# Altium schematic sheet MAIN.SchDoc
size A4; SheetNumber: 1; SheetTotal: 1; SPICEModelCacheFDUFBSJX: <root> / <DocumentId>FDUFBSJX</DocumentId> / </root>
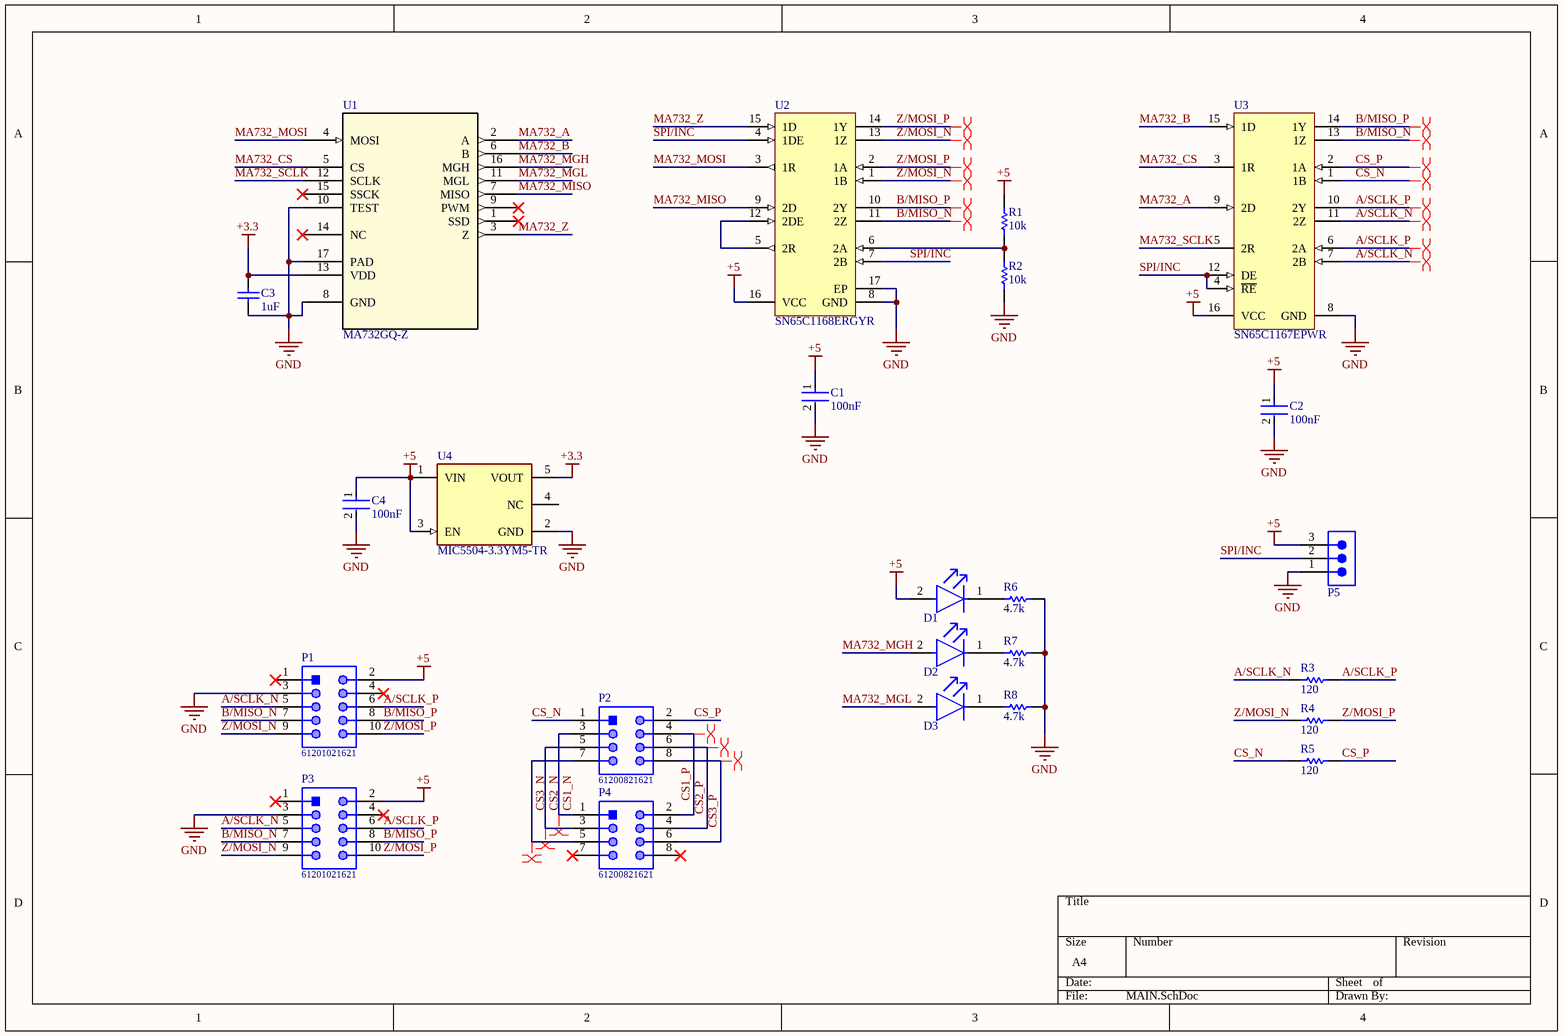
[diagram p0: MAIN.SchDoc]

## Parts
C1  100nF  [FP-C0805C-DN-MFG]
C2  100nF  [FP-C0805C-DN-MFG]
C3  1uF  [CAPC2013X70X45NL10T25]
C4  100nF  [FP-C0805C-DN-MFG]
D1  150080SS75000  [FP-150080SS75000-MFG]  (value not drawn)
D2  150080SS75000  [FP-150080SS75000-MFG]  (value not drawn)
D3  150080SS75000  [FP-150080SS75000-MFG]  (value not drawn)
P1  61201021621  [61201021621]
P2  61200821621  [61200821621]
P3  61201021621  [61201021621]
P4  61200821621  [61200821621]
P5  TSW-103-07-T-S  [SMTC-TSW-103-07-X-S]  (value not drawn)
R1  10k  [RESC2013X60X40LL20T25_A]
R2  10k  [RESC2013X60X40LL20T25_A]
R3  120  [RESC2013X60X40ML20T25]
R4  120  [RESC2013X60X40ML20T25]
R5  120  [RESC2013X60X40ML20T25]
R6  4.7k  [RESC2013X70X40NL20T20]
R7  4.7k  [RESC2013X70X40NL20T20]
R8  4.7k  [RESC2013X70X40NL20T20]
U1  MA732GQ-Z  [QFN-16_MA732]
U2  SN65C1168ERGYR  [RGY0016A_V]
U3  SN65C1167EPWR  [PW0016A_M]
U4  MIC5504-3.3YM5-TR  [FP-SOT23-5LD-PL-1-MFG]

## Nets
+3.3: C3.2 U1.13(VDD) U4.5(VOUT)
+5: C1.1 C2.1 C4.1 D1.2(A) P1.2 P3.2 P5.3 R1.2 U2.16(VCC) U3.16(VCC) U4.1(VIN) U4.3(EN)
GND: C1.2 C2.2 C3.1 C4.2 P1.3 P3.3 P5.1 R2.1 R6.2 R7.2 R8.2 U1.8(GND) U1.10(TEST) U1.17(PAD) U2.8(GND) U2.17(EP) U3.8(GND) U4.2(GND)
A/SCLK_N: P1.5 P3.5 R3.1 U3.7(2B) U3.11(2Z)
A/SCLK_P: P1.6 P3.6 R3.2 U3.6(2A) U3.10(2Y)
B/MISO_N: P1.7 P3.7 U2.11(2Z) U3.13(1Z)
B/MISO_P: P1.8 P3.8 U2.10(2Y) U3.14(1Y)
CS1_N: P2.3 P4.1
CS1_P: P2.4 P4.2
CS2_N: P2.5 P4.3
CS2_P: P2.6 P4.4
CS3_N: P2.7 P4.5
CS3_P: P2.8 P4.6
CS_N: P2.1 R5.1 U3.1(1B)
CS_P: P2.2 R5.2 U3.2(1A)
MA732_A: U1.2(A) U3.9(2D)
MA732_B: U1.6(B) U3.15(1D)
MA732_CS: U1.5(CS) U3.3(1R)
MA732_MGH: D2.2(A) U1.16(MGH)
MA732_MGL: D3.2(A) U1.11(MGL)
MA732_MISO: U1.7(MISO) U2.9(2D)
MA732_MOSI: U1.4(MOSI) U2.3(1R)
MA732_SCLK: U1.12(SCLK) U3.5(2R)
MA732_Z: U1.3(Z) U2.15(1D)
SPI/INC: P5.2 U2.4(1DE) U2.7(2B) U3.4(~{RE}) U3.12(DE)
Z/MOSI_N: P1.9 P3.9 R4.1 U2.1(1B) U2.13(1Z)
Z/MOSI_P: P1.10 P3.10 R4.2 U2.2(1A) U2.14(1Y)
NetD1_1: D1.1(C) R6.1
NetD2_1: D2.1(C) R7.1
NetD3_1: D3.1(C) R8.1
NetR1_1: R1.1 R2.2 U2.6(2A)
NetU2_5: U2.5(2R) U2.12(2DE)

Not connected (* = marked no-connect by the designer): P1 1* 4*; P3 1* 4*; P4 7* 8*; U1 1(SSD)* 9(PWM)* 14(NC)* 15(SSCK)*; U4 4(NC)

## Layout directives
differential pair: A/SCLK_N, A/SCLK_P, B/MISO_N, B/MISO_P, CS1_N, CS1_P, CS2_N, CS2_P, CS3_N, CS3_P, CS_N, CS_P, Z/MOSI_N, Z/MOSI_P

## Library data of the parts
C1 C2 C4 = CMP-2007-00279-2: CAP CER 0.1UF 50V X7R 0805; Manufacturer Part Number: C0805C104K5RACTU; Manufacturer: KEMET; Value: 0.10 μF; Tolerance: 0.1; Temperature Coefficient: 30ppm/°C; Material: Ceramic; Device Class L2: Capacitors; Temperature Range Low: -55°C; Voltage Rating: 50 V; Digikey Description: CAP CER 0.1UF 50V X7R 0805; Category: Cap; ComponentLink2Description: Datasheet; Octopart: https://octopart.com/c0805c104k5ractu-kemet-143926; RoHS: TRUE; ComponentLink2URL: https://content.kemet.com/datasheets/KEM_C1003_C0G_SMD.pdf; Temperature Characteristic: X7R; Temperature: -55°C to +125°C; Height: 0.88mm; Temperature Range High: +125°C; Device Class L1: Passive Components; Automotive: No; Lead Free: Yes; Ipc Land Pattern Name: CAPC200125X78; Device Class L3: Ceramic Capacitors; Mouser Description: Cap Ceramic 0.1uF 50V X7R 10% SMD 2.0 x 1.2 mm 125 C Paper T/R; Capacitance: 0.10 μF; Package: C0805C-DN
C3 = CMP-2007-00957-1: Part Number: GRM216R61E105KA12D; Manufacturer: Murata
D1-D3 = CMP-1426-00010-2: LED RED CLEAR 0805 SMD; Forward Voltage: 1.9V; Luminous Intensity: 60mcd; Dominant Wavelength: 630nm; Forward Current: 30mA; Viewing Angle: 140°; Lens Color: Colorless; Test Current: 20mA; Lens Size: 1.25mm; Packaging: Cut Tape; Width: 1.25mm; Case Code (Metric): 2012; Max Operating Temperature: 85°C; RoHS Compliant: Yes; Mount: Surface Mount; Case/Package: 0805; Series: WL-SMCW; Length: 2mm; Case Code (Imperial): 0805; Wavelength: 630nm; Lens Style: Clear; Min Operating Temperature: -40°C; Color: Red; Lens Transparency: Clear; Package Quantity: 1; Height: 0.8mm
P1 P3 = CMP-1502-00007-1: Male Box Header WR-BHD, THT, Vertical, pitch 2.54 mm, 10 pins; Manufacturer: Wurth Elektronik; Contact Resistance: 20mOhm; Withstanding Voltage: 500VAC; Pin Number: 10; Working Voltage: 250VAC; Pitch: 2.54mm; Mounting Technology: THT; Operating Temperature: -40to125degC; Published Date: August2018; Gender: Male; Packaging: Tray; Manufacturer URL: http://www.we-online.de; Datasheet URL: https://katalog.we-online.de/em/datasheet/6120xx21621.pdf; Orientation: Vertical; Package Reference: 61201021621; Part Number: 61201021621; Publisher: WurthElektronik
P2 P4 = CMP-1502-00006-1: Male Box Header WR-BHD, THT, Vertical, pitch 2.54 mm, 8 pins; Manufacturer: Wurth Elektronik; Working Voltage: 250VAC; Withstanding Voltage: 500VAC; Contact Resistance: 20mOhm; Pitch: 2.54mm; Pin Number: 8; Datasheet URL: https://katalog.we-online.de/em/datasheet/6120xx21621.pdf; Mounting Technology: THT; Publisher: WurthElektronik; Orientation: Vertical; Part Number: 61200821621; Operating Temperature: -40to125degC; Gender: Male; Packaging: Tray; Published Date: August2018; Package Reference: 61200821621; Manufacturer URL: http://www.we-online.de
P5 = CMP-1024-00332-1: 0.025" SQ Post Header, Through-hole, Vertical, -55 to 105 degC, 2.54 mm Pitch, 3-Pin, Male, RoHS; Manufacturer: Samtec; Pitch: 2.54 mm; ComponentLink1URL: http://www.samtec.com; ComponentLink3URL: http://www.samtec.com/documents/webfiles/cpdf/TSW-XXX-XX-XXX-X-XX-XXX-MKT.pdf; PartNumber: TSW-103-07-T-S; Mounting Technology: Through-hole; RoHS: True; DatasheetVersion: F-214; PackageVersion: DM, 8/1988; Temperature Range: -55 to 105 degC; ComponentLink2Description: Datasheet; ComponentLink1Description: Manufacturer URL; Orientation: Vertical; PackageReference: TSW-103-07-X-S; ComponentLink3Description: Package Specification; ComponentLink2URL: http://www.samtec.com/documents/webfiles/pdf/TSW_TH.PDF; PackageDescription: .025[0.64] SQ. Post Terminal Strip Assembly
R1 R2 = CMP-2001-00582-2: Metal Film Chip Resistor, High Reliability Type, 0.125 W, +/- 0.1%, -55 to 155 degC, 0805 (2012 Metric), RoHS, Tape and Reel; Voltage Rating: 100V; Power Rating: 125mW(1/8W); Brand: Panasonic; Temperature Coefficient: 25PPM/C; Resistance: 10kOhms; Product Category: ThinFilmResistors-SMD; Datasheet Version: 02/2016; Operating Temperature Range: -55Cto+155C; Length: 2mm; Mounting Technology: SurfaceMount; Manufacturer URL: http://www.panasonic.com/; Width: 1.25mm; Packaging: Reel; Product: ThinFilmResistorsSMD; Package / Case: 0805(2012metric); Termination Style: SMD/SMT; Tolerance: 0.1%; Datasheet URL: https://industrial.panasonic.com/cdbs/www-data/pdf/RDM0000/AOA0000C307.pdf; Package Description: 2-Pin Surface Mount Device, Body 2 x 1.25 mm; Factory Pack Quantity: 5000; Series: ERA-6A; Case Code - mm: 2012; RoHS: Details; Package Reference: 0805; Height: 0.5mm; Manufacturer: Panasonic; Case Code - in: 0805; Type: MetalFilmChipResistors
R3-R5 = CMP-2001-00588-1: Manufacturer: Panasonic; Part Number: ERA6AEB121V
R6-R8 = CMP-2001-00550-5: Chip Resistor, 4.7 KOhm, +/- 1%, 0.125 W, -55 to 155 degC, 0805 (2012 Metric), RoHS, Tape and Reel; Manufacturer: Panasonic; Voltage Rating: 150 V; Min Operating Temperature: -55 degC; PackageReference: 0805; Mounting Technology: Surface Mount; Height: 0.6 mm; PackageDescription: 2-Pin Surface Mount Device, Body 2 x 1.25 mm; RoHSCompliant: true; Length: 2 mm; REACH SVHC: Yes; Packaging: Tape and Reel; Pins: 2; Mount: Surface Mount; ComponentLink2Description: Datasheet; ComponentLink1URL: http://www.panasonic.com/; ComponentLink1Description: Manufacturer URL; DatasheetVersion: 04/2015; Package Quantity: 5000; ComponentLink2URL: http://industrial.panasonic.com/cdbs/www-data/pdf/RDA0000/AOA0000C86.pdf; Max Operating Temperature: 155 degC
U1 = MA732GQ-Z: No Description Available; Mfr_Name: Monolithic Power Systems; Copyright: Copyright (C) 2023 Ultra Librarian. All rights reserved.; Manufacturer_Part_Number: MA732GQ-Z; RefDes: RefDes; Type: DEV
U2 = CMP-0310-00131-3: None; Nominal Supply Current: 9mA; Number of Transmitters: 2; Data Rate: 10Mbps; Operating Supply Voltage: 5V; Logic Function: Transceiver; Max Supply Voltage: 5.5V; Propagation Delay: 8ns; Output Current: 20uA; Output Voltage: 3.5V; Min Supply Voltage: 4.5V; Number of Transceivers: 1; RoHS Compliant: Yes; Weight: 0.001312oz; Package Quantity: 1; Lead Free: Lead Free; Supply Current: 9mA; Number of Drivers: 2; Min Operating Temperature: -40°C; Series: -; Radiation Hardening: No; Number of Pins: 16; Number of Receivers: 2; Packaging: Tape and Reel; Max Operating Temperature: 85°C; Case/Package: VQFN EP; Operating Supply Current: 9mA
U3 = CMP-0310-00539-2: Dual Differential Driver and Receiver with +/-15-kV IEC ESD Protection, 2 TX / 2 RX, 5V, -40 to 85 degC, 16-Pin TSSOP(PW), Green (RoHS & no Sb/Br); Manufacturer: Texas Instruments; ESD(kV): 15; Supply Voltage(s)(V): 5; Receivers Per Package: 2; Rating: Catalog; SubFamily: RS-422; ICC(Max)(mA): 9; ComponentLink1Description: Datasheet; PackageVersion: revG, Feb-2011; PartNumber: SN65C1167EPWR; PackageDescription: 16-Pin Plastic Thin Small Outline Package 5 x 4.4 mm Body ,0.65 mm Pitch; DatasheetVersion: SLLS740A; Mounting Technology: Surface Mount; Eco-Plan: Green (RoHS & no Sb/Br); PackageReference: PW0016A; # of TX/RX: 2 TX / 2 RX; ComponentLink1URL: http://www.ti.com/general/docs/lit/getliterature.tsp?genericPartNumber=SN65C1167E&fileType=pdf; Footprint: MC34050; Drivers Per Package: 2; ComponentLink2Description: Package Specification; ComponentLink2URL: http://www.ti.com/lit/ml/mpds361/mpds361.pdf; Code_JEDEC: MO-153
U4 = CMP-2000-07604-2: IC REG LINEAR 3.3V 300MA SOT23-5; Quiescent Current: 38uA; Operating Supply Current: 42uA; Max Input Voltage: 5.5V; Min Input Voltage: 2.5V; Output Type: Fixed; Power Supply Rejection Ratio (PSRR): 60dB; Dropout Voltage: 380mV; Accuracy: 3%; Number of Outputs: 1; Nominal Output Voltage: 3.3V; Max Output Current: 300mA; Length: 2.9mm; Mount: Surface Mount; Width: 1.6mm; Packaging: Tape and Reel; Output Current: 300mA; Min Operating Temperature: -40°C; Max Operating Temperature: 125°C; Height: 1.1mm; Case/Package: SOT-23-5; REACH SVHC: No SVHC; Number of Pins: 5; Output Voltage: 3.3V